# Altium schematic sheet ERA-51SM+.SchDoc
size A4
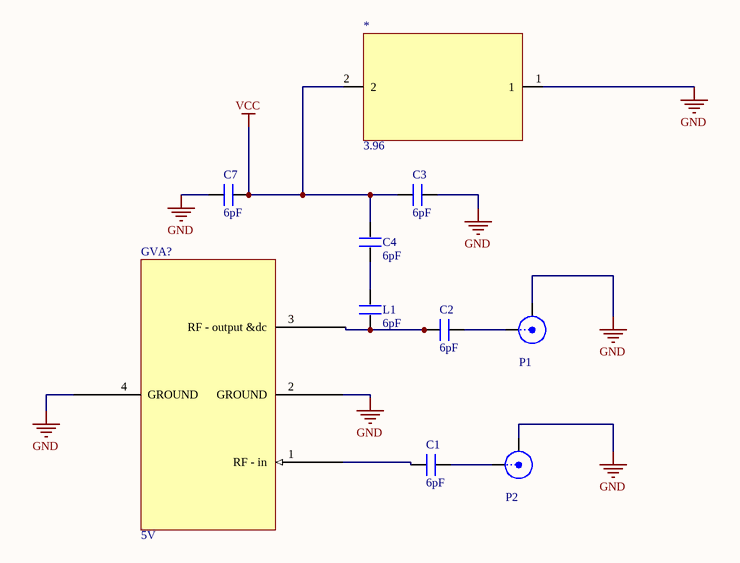
[diagram p0: ERA-51SM+.SchDoc]

## Parts
*  3.96  [3.96]
C1  6pF  [0402]
C2  6pF  [0402]
C3  6pF  [1206C]
C4  6pF  [0603C]
C7  6pF  [0603C]
GVA?  5V  [WX107]
L1  6pF  [0402]
P1  SMA  [SMA]  (value not drawn)
P2  SMA  [SMA]  (value not drawn)

## Nets
GND: *.1 C3.2 C7.1 GVA?.2(GROUND) GVA?.4(GROUND) P1.2(Y) P2.2(Y)
VCC: *.2 C3.1 C4.2 C7.2
NetC1_1: C1.1 GVA?.1(RF_-_in)
NetC1_2: C1.2 P2.1(X)
NetC2_1: C2.1 GVA?.3(RF_-_output_&dc) L1.1
NetC2_2: C2.2 P1.1(X)
NetC4_1: C4.1 L1.2

## Library data of the parts
C1-C4 C7 L1 = C: Capacitor
GVA? = GVA-81+
P1 P2 = SMA: SMA Connector